# Altium schematic sheet Amplifier.SchDoc
size A
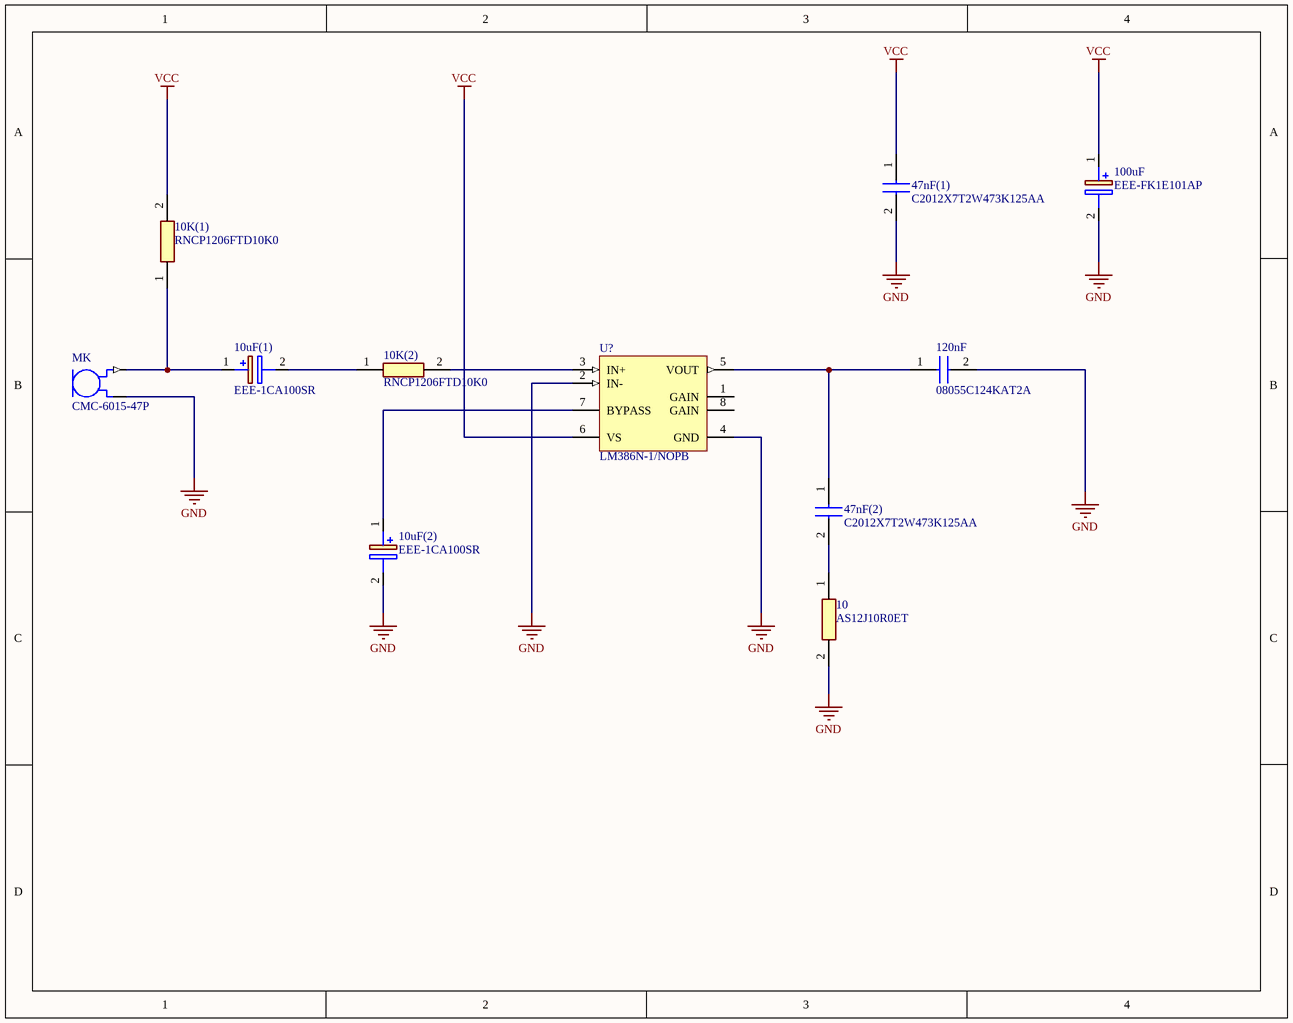
[diagram p0: Amplifier.SchDoc]

## Parts
10  AS12J10R0ET  [RESC3116X65N]
10K(1)  RNCP1206FTD10K0  [RESC3115X60N]
10K(2)  RNCP1206FTD10K0  [RESC3115X60N]
10uF(1)  EEE-1CA100SR  [CAPAE430X550N]
10uF(2)  EEE-1CA100SR  [CAPAE430X550N]
47nF(1)  C2012X7T2W473K125AA  [CAPC2012X145N]
47nF(2)  C2012X7T2W473K125AA  [CAPC2012X145N]
100uF  EEE-FK1E101AP  [CAPAE830X650N]
120nF  08055C124KAT2A  [CAPC2012X102N]
MK  CMC-6015-47P  [CUI_CMC-6015-47P]
U?  LM386N-1/NOPB  [P0008A]

## Nets
GND: 10.2 10uF(2).2(-) 47nF(1).2 100uF.2(-) 120nF.2 MK.GND U?.2(IN-) U?.4(GND)
VCC: 10K(1).2 47nF(1).1 100uF.1(+) U?.6(VS)
Net10_1: 10.1 47nF(2).2
Net10K(1)_1: 10K(1).1 10uF(1).1(+) MK.OUT
Net10K(2)_1: 10K(2).1 10uF(1).2(-)
Net10K(2)_2: 10K(2).2 U?.3(IN+)
Net10uF(2)_1: 10uF(2).1(+) U?.7(BYPASS)
Net47nF(2)_1: 47nF(2).1 120nF.1 U?.5(VOUT)

Not connected (* = marked no-connect by the designer): U? 1(GAIN) 8(GAIN)

## Notes on the sheet
- Title
- Size:
- Date:
- B
- Number:
- Time:
- Revision:
- Sheet
- of
- File:

## Library data of the parts
10 = AS12J10R0ET: Resistor; Manufacturer_Name: Ohmite; Datasheet Link: http://www.ohmite.com/cat/res_as_smd.pdf; Height: 0.65mm; Manufacturer_Part_Number: AS12J10R0ET; Mouser Part Number: 588-AS12J10R0ET; Mouser Price/Stock: https://www.mouser.com/Search/Refine.aspx?Keyword=588-AS12J10R0ET
10K(1) 10K(2) = RNCP1206FTD10K0: Resistor; Manufacturer_Name: Stackpole Electronics Inc.; Datasheet Link: https://www.seielect.com/Catalog/SEI-rncp.pdf; Height: 0.6mm; Manufacturer_Part_Number: RNCP1206FTD10K0; Arrow Part Number: RNCP1206FTD10K0; Arrow Price/Stock: https://www.arrow.com/en/products/rncp1206ftd10k0/stackpole-electronics
10uF(1) 10uF(2) = EEE-1CA100SR: Capacitor Polarised; Manufacturer_Name: Panasonic; Datasheet Link: https://industrial.panasonic.com/cdbs/www-data/pdf/RDE0000/ABA0000C1145.pdf; Height: 5.5mm; Manufacturer_Part_Number: EEE-1CA100SR; Mouser Part Number: 667-EEE-1CA100SR; Mouser Price/Stock: https://www.mouser.co.uk/ProductDetail/Panasonic/EEE-1CA100SR/?qs=ANJC8C65Mw5HUsKv8znGCA%3D%3D; Arrow Part Number: EEE-1CA100SR; Arrow Price/Stock: https://www.arrow.com/en/products/eee-1ca100sr/panasonic
47nF(1) 47nF(2) = C2012X7T2W473K125AA: Capacitor; Manufacturer_Name: TDK; Datasheet Link: https://product.tdk.com/info/en/catalog/datasheets/mlcc_commercial_midvoltage_en.pdf; Height: 1.45mm; Manufacturer_Part_Number: C2012X7T2W473K125AA; Mouser Part Number: 810-C2012X7T2W473KAA; Mouser Price/Stock: https://www.mouser.com/Search/Refine.aspx?Keyword=810-C2012X7T2W473KAA
100uF = EEE-FK1E101AP: Capacitor Polarised; Manufacturer_Name: Panasonic; Datasheet Link: https://www.arrow.com/en/products/eee-fk1e101ap/panasonic; Height: 6.5mm; Manufacturer_Part_Number: EEE-FK1E101AP; Mouser Part Number: 667-EEE-FK1E101AP; Mouser Price/Stock: https://www.mouser.co.uk/ProductDetail/Panasonic/EEE-FK1E101AP?qs=d1CqaRUMZD9CFi%252BHQcL%2FoA%3D%3D; Arrow Part Number: EEE-FK1E101AP; Arrow Price/Stock: https://www.arrow.com/en/products/eee-fk1e101ap/panasonic
120nF = 08055C124KAT2A: Capacitor; Manufacturer_Name: AVX; Datasheet Link: http://uk.rs-online.com/web/p/products/8881548; Height: 1.02mm; Manufacturer_Part_Number: 08055C124KAT2A; Mouser Part Number: 581-08055C124KAT2A; Mouser Price/Stock: https://www.mouser.co.uk/ProductDetail/AVX/08055C124KAT2A?qs=DB8SHAIt2m6%252B45Ljt%252BbRtQ%3D%3D; Arrow Part Number: 08055C124KAT2A; Arrow Price/Stock: https://www.arrow.com/en/products/08055c124kat2a/avx
MK = CMC-6015-47P: 6.0 mm, Unidirectional, PCB Mount, 2.0 Vdc, Electret Condenser Microphone; MF: CUI Devices; CUI_purchase_URL: https://www.cuidevices.com/product/audio/microphones/electret-condenser-microphones/cmc-6015-47p?utm_source=snapeda.com&utm_medium=referral&utm_campaign=snapedaBOM; MP: CMC-6015-47P; SnapEDA_Link: https://www.snapeda.com/parts/CMC-6015-47P/CUI%20Devices/view-part/2680091/?ref=snap; Price: None; Package: CUI Inc.; Value: *; Availability: Unavailable
U? = CMP-0057-00052-4: Low Voltage Audio Power Amplifier, 8-pin MDIP, Pb-Free; Manufacturer: Texas Instruments; PackageTopMarking: NSUZXYTTE#*LM*386N-1; PowerWise: N; CompType: Audio IC; RoHS: Y; PackageReference: P0008A; Code_JEDEC: MS-001-BA; PackageDescription: MDIP, .365 x .250 x .130in, 8 Lead, .100in Pitch; PinCount: 8; ComponentLink1URL: http://www.ti.com/general/docs/lit/getliterature.tsp?genericPartNumber=LM386&fileType=pdf; ComponentLink1Description: Datasheet URL